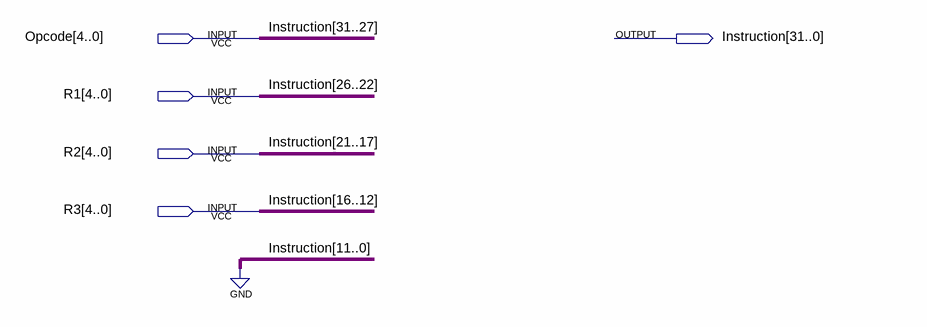
[diagram p0: schematic sheet]
// Quartus schematic RTypeCombiner.bdf as structural Verilog: 0 symbols, 5 pins
module RTypeCombiner (
  input  [4:0] Opcode,
  input  [4:0] R1,
  input  [4:0] R2,
  input  [4:0] R3,
  output [31:0] Instruction
);


  assign Instruction = {Opcode, R1, R2, R3, {12{1'b0}}};
endmodule
